# EAGLE board Main board Giulia (EAGLE 6.6.0)
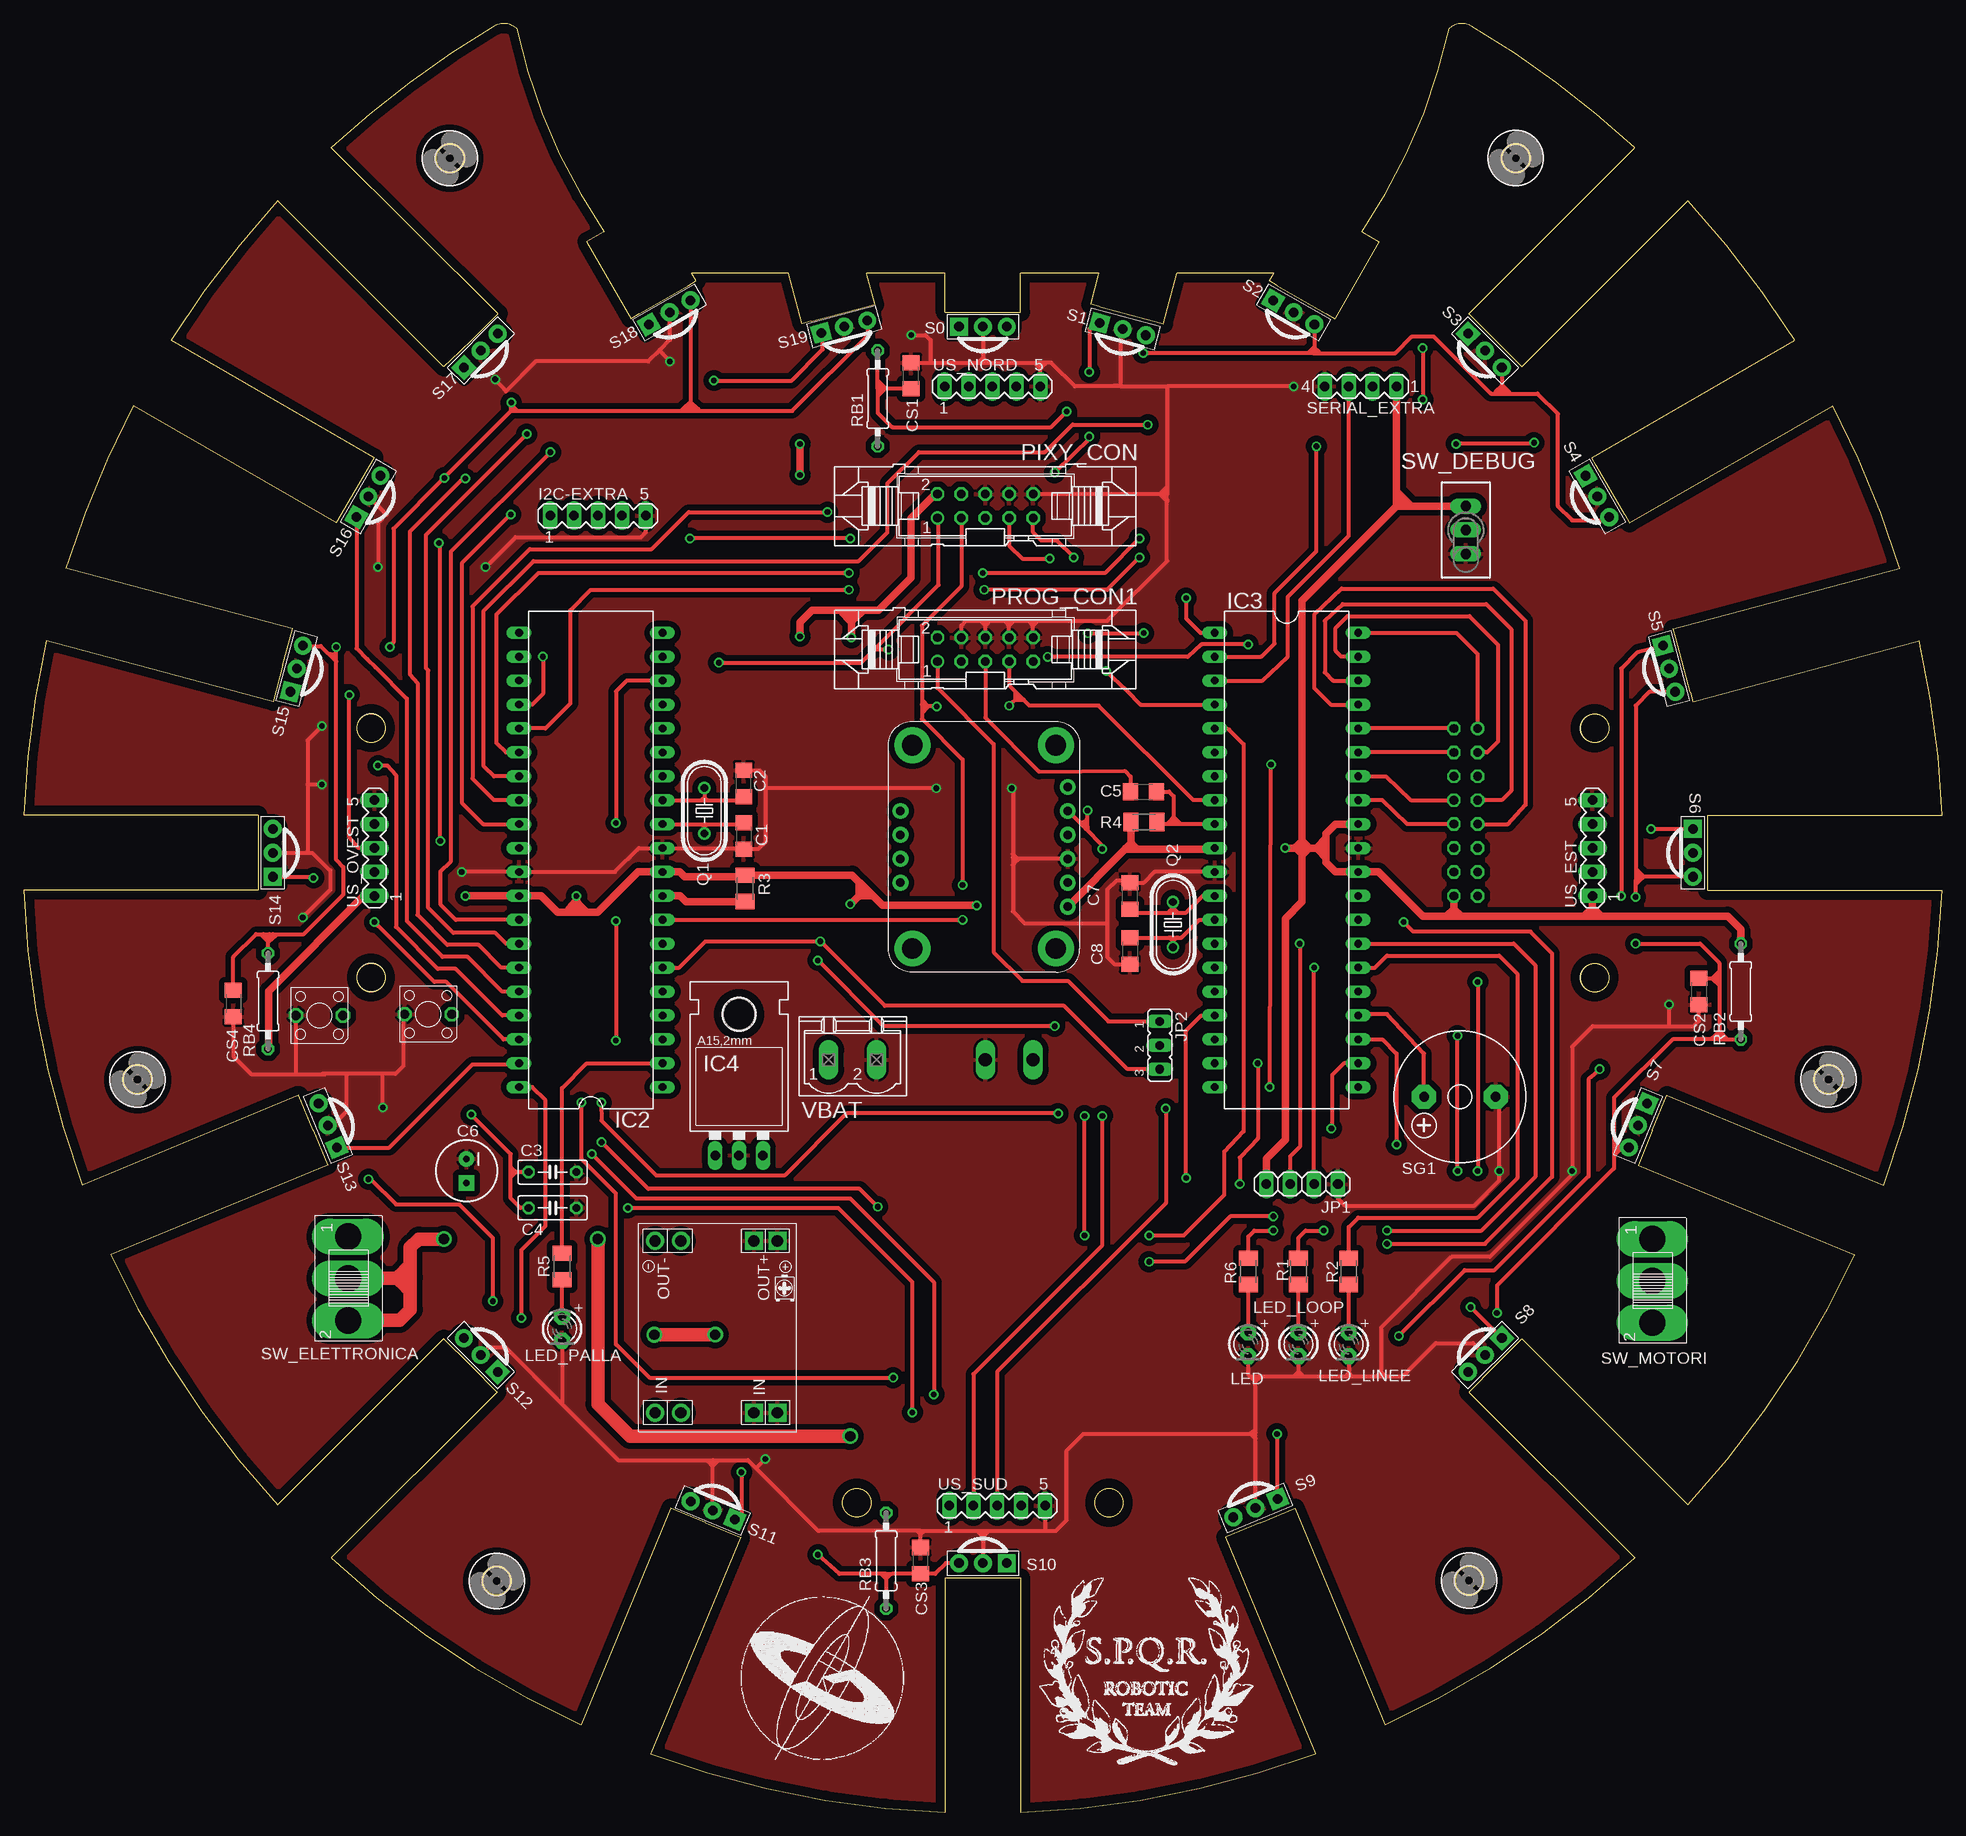
[diagram p1: board, top side]
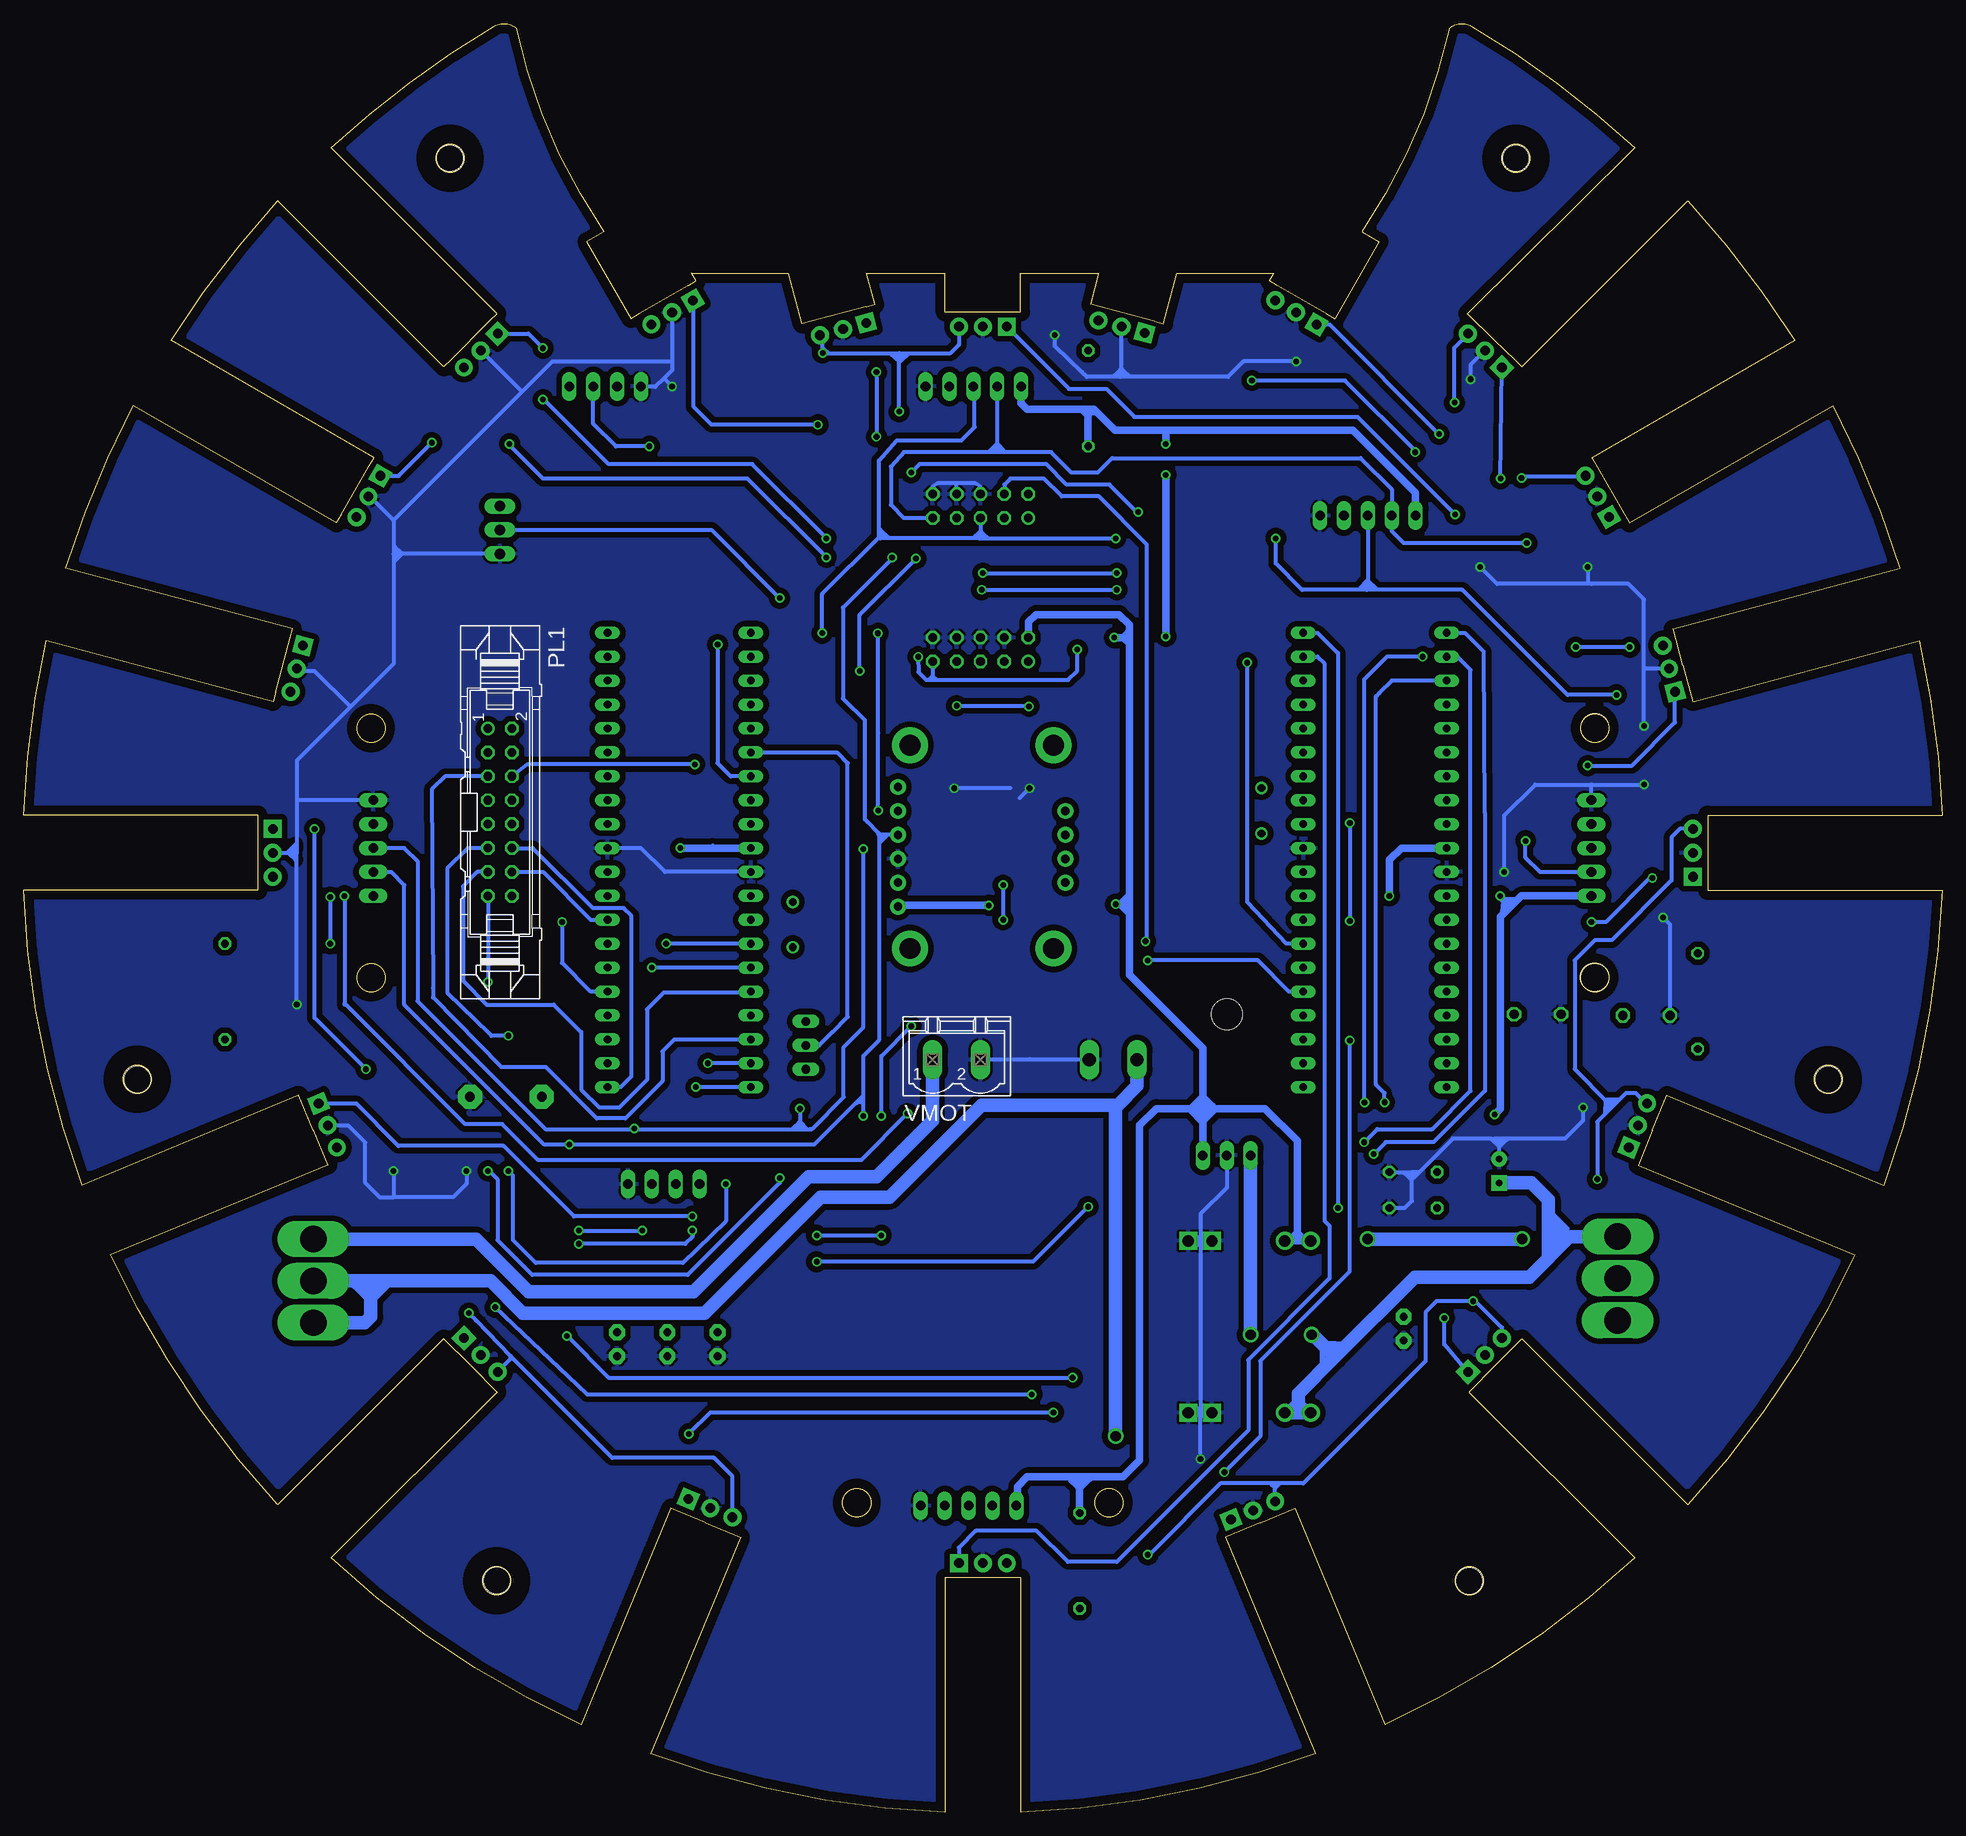
[diagram p2: board, bottom side, seen from below]

Size 203.84 x 190 mm. Coordinates in mm from the lower left corner, seen from the top.
Outline: 176.82,32.68 arc18 194.55,59.22 171.53,68.76 173.06,72.45 174.59,76.15 197.62,66.61 arc18 203.84,97.92 178.92,97.92 178.92,105.92 203.84,105.92 arc11 201.41,124.44 177.33,117.99 177.07,118.95 175.52,124.75 175.26,125.71 199.33,132.16 arc11 192.19,149.42 170.61,136.96 170.11,137.82 167.11,143.02 166.61,143.89 188.17,156.37 arc10 176.82,171.16 159.2,153.54 158.49,154.25 154.25,158.49 153.54,159.2 171.16,176.82 arc12 153.84,189.72 arc73 151.48,189.49 arc-22 142.18,167.88 144.01,166.83 139.3,158.66 138.43,159.16 133.24,162.16 132.37,162.66 132.85,163.48 122.56,163.48 121.12,158.11 120.15,158.37 114.36,159.92 113.39,160.18 114.28,163.48 105.92,163.48 105.92,159.36 97.92,159.36 97.92,163.48 89.57,163.48 90.45,160.18 89.49,159.92 83.69,158.37 82.72,158.11 81.28,163.48 71,163.48 71.47,162.66 70.61,162.16 65.41,159.16 64.55,158.66 59.83,166.83 61.66,167.88 arc-22 52.36,189.49 arc73 50.01,189.72 arc12 32.68,176.82 50.43,159.2 47.6,156.37 45.35,154.25 44.65,153.54 27.02,171.16 arc10 15.67,156.37 37.24,143.89 33.24,136.96 11.65,149.42 arc11 4.51,132.16 28.58,125.71 27.55,121.85 26.51,117.99 2.44,124.44 arc11 0,105.92 24.92,105.92 24.92,97.92 0,97.92 arc18 6.23,66.61 29.25,76.15 30.78,72.45 32.31,68.76 9.29,59.22 arc18 27.02,32.68 44.65,50.3 47.47,47.47 50.3,44.65 32.68,27.02 arc18 59.22,9.29 68.76,32.31 72.45,30.78 76.15,29.25 66.61,6.23 arc18 97.92,0 97.92,24.92 105.92,24.92 105.92,0 arc18 137.23,6.23 127.69,29.25 131.39,30.78 135.08,32.31 144.62,9.29 arc18 171.16,27.02 153.54,44.65 156.37,47.47 159.2,50.3 176.82,32.68
Outline: circle at 36.92,88.67 radius 1.5
Outline: circle at 36.92,115.17 radius 1.5
Outline: circle at 166.92,88.67 radius 1.5
Outline: circle at 166.92,115.17 radius 1.5
Outline: circle at 88.52,32.9 radius 1.5
Outline: circle at 50.25,24.59 radius 1.5
Outline: circle at 12.09,77.85 radius 1.5
Outline: circle at 45.31,175.7 radius 1.5
Outline: circle at 191.75,77.85 radius 1.5
Outline: circle at 158.54,175.7 radius 1.5
Outline: circle at 153.59,24.59 radius 1.5
Outline: circle at 166.92,115.17 radius 1.5
Outline: circle at 115.32,32.9 radius 1.5
Copper layers (1*16): Top 0.035mm / dielectric 1.5mm / Bottom 0.035mm
Design rules "default": minimum track width 10mil, minimum drill 24mil, track to track 8mil, track to pad 8mil, pad to pad 8mil, via to via 8mil, smd to smd 8mil, copper to edge 40mil, drill to drill 8mil, minimum pad ring 10mil, minimum via ring 8mil, stop-mask expansion 4mil, vias tented up to drill 0mil, thermal gap 10mil
Net classes: 0 default: width 0.152 mm; 1 Power: width 0.406 mm, clearance 0.61 mm
Holes 3 mm at 88.53,32.89 115.32,32.88 166.92,88.66 166.91,115.14 36.93,88.69 36.92,115.18

## Footprints (pad centres in the part's own frame; a part is rotated, then mirrored left to right if it is on the bottom)
C1206 = smd 1.6 x 1.8: 1 -1.4,0; 2 1.4,0
C050-025X075 = drill 0.813 octagon: 1 -2.54,0; 2 2.54,0
CPOL-RADIAL-100UF-25V = drill 0.7 pad 1.651 square: 1 1.27,0 | drill 0.7 pad 1.651: 2 -1.27,0
MA05-1 = drill 1.016 long: 1 -5.08,0; 2 -2.54,0; 3 0,0; 4 2.54,0; 5 5.08,0
DIL40 = drill 0.813 long: 1 -24.13,-7.62; 2 -21.59,-7.62; 3 -19.05,-7.62; 4 -16.51,-7.62; 5 -13.97,-7.62; 6 -11.43,-7.62; 7 -8.89,-7.62; 8 -6.35,-7.62; 9 -3.81,-7.62; 10 -1.27,-7.62; 11 1.27,-7.62; 12 3.81,-7.62; 13 6.35,-7.62; 14 8.89,-7.62; 15 11.43,-7.62; 16 13.97,-7.62; 17 16.51,-7.62; 18 19.05,-7.62; 19 21.59,-7.62; 20 24.13,-7.62; 21 24.13,7.62; 22 21.59,7.62; 23 19.05,7.62; 24 16.51,7.62; 25 13.97,7.62; 26 11.43,7.62; 27 8.89,7.62; 28 6.35,7.62; 29 3.81,7.62; 30 1.27,7.62; 31 -1.27,7.62; 32 -3.81,7.62; 33 -6.35,7.62; 34 -8.89,7.62; 35 -11.43,7.62; 36 -13.97,7.62; 37 -16.51,7.62; 38 -19.05,7.62; 39 -21.59,7.62; 40 -24.13,7.62
78XXL = drill 1.016 long: GND 0,-3.81; IN -2.54,-3.81; OUT 2.54,-3.81 | hole 3.302: 0,11.176
1X04 = drill 1.016 long: 1 -3.81,0; 2 -1.27,0; 3 1.27,0; 4 3.81,0
JP2 = drill 0.914 long: 1 -2.54,0; 2 0,0; 3 2.54,0
LED3MM = drill 0.813 pad 1.676 octagon: A -1.27,0; K 1.27,0
10V = drill 0.914: 1 -5.08,-1.27 | drill 0.914 octagon: 2 -5.08,1.27; 3 -2.54,-1.27; 4 -2.54,1.27; 5 0,-1.27; 6 0,1.27; 7 2.54,-1.27; 8 2.54,1.27; 9 5.08,-1.27; 10 5.08,1.27
16V = drill 0.914: 1 -8.89,-1.27 | drill 0.914 octagon: 2 -8.89,1.27; 3 -6.35,-1.27; 4 -6.35,1.27; 5 -3.81,-1.27; 6 -3.81,1.27; 7 -1.27,-1.27; 8 -1.27,1.27; 9 1.27,-1.27; 10 1.27,1.27; 11 3.81,-1.27; 12 3.81,1.27; 13 6.35,-1.27; 14 6.35,1.27; 15 8.89,-1.27; 16 8.89,1.27
HC49U-V = drill 0.813: 1 -2.413,0; 2 2.413,0
M1206 = smd 1.6 x 2: 1 -1.4,0; 2 1.4,0
0207/10 = drill 0.813 octagon: 1 -5.08,0; 2 5.08,0
PNA460XM = drill 1.016 pad 1.9 square: 1 -2.54,0 | drill 1.016 pad 1.9: 2 0,0; 3 2.54,0
MA04-1 = drill 1.016 long: 1 -3.81,0; 2 -1.27,0; 3 1.27,0; 4 3.81,0
F/CM12P = drill 1.016 pad 2.54 octagon: + 3.81,0; - -3.81,0
SWITCH_EVQ2 = drill 1 octagon: P$1 -2.5,0; P$2 2.5,0
TL3XPO = drill 1.1 pad 1.422 long: 1 -2.54,0; 2 0,0; 3 2.54,0
255SB = drill 2.8 pad 3.048 long: 1 2.667,3.556; 2 7.112,3.556; 3 11.557,3.556
MINI3ADCDCLM2595 = drill 1.2 pad 1.93: P$1 20.25,-1.75; P$2 2,-1.75; P$7 2,-4.5; P$8 20.25,-4.5 | drill 1.2 pad 1.93 square: P$3 2,-14.75; P$4 20.25,-14.75; P$5 2,-12.25; P$6 20.25,-12.25
BNO055 = drill 0.9 pad 1.676: 3V3 9.525,1.27; ADR 17.145,19.05; GND 12.065,1.27; INT 14.605,19.05; PS0 9.525,19.05; PS1 12.065,19.05; RST 19.685,1.27; SCL 17.145,1.27; SDA 14.605,1.27; VIN 6.985,1.27 | drill 2.2 pad 3.81: P$1 2.54,17.78; P$2 2.54,2.54; P$3 24.13,2.54; P$4 24.13,17.78
2,8 = hole 2.8: 0,0
MSTBV2 = drill 1.397 long: 1 -2.54,0; 2 2.54,0

## Placement (x,y rotation side)
C1  18p  [C1206]  76.52,103.7 270 top
C2  18p  [C1206]  76.52,109.29 90 top
C3  100n  [C050-025X075]  56.2,68.01 0 top
C4  100n  [C050-025X075]  56.2,64.2 0 top
C5  0.1uF  [C1206]  118.98,108.41 0 top
C6  47uF  [CPOL-RADIAL-100UF-25V]  47.06,68.14 270 top
C7  18p  [C1206]  117.54,97.35 90 top
C8  18p  [C1206]  117.54,91.51 270 top
CS1  22uF  [C1206]  94.3,152.59 90 top
CS2  22uF  [C1206]  177.99,87.19 270 top
CS3  22uF  [C1206]  95.32,26.74 90 top
CS4  22uF  [C1206]  22.29,85.92 270 top
I2C-EXTRA  [MA05-1]  61.03,137.74 0 top
IC2  ATMEGA644-20PU  [DIL40]  60.27,101.16 90 top
IC3  ATMEGA644-20PU  [DIL40]  134.18,101.16 270 top
IC4  [78XXL]  76.01,73.6 0 top
JP1  [1X04]  135.83,66.74 180 top
JP2  [JP2]  120.72,81.47 270 top
LED  [LED3MM]  130.12,49.72 270 top
LED_LINEE  [LED3MM]  140.78,49.72 270 top
LED_LOOP  [LED3MM]  135.45,49.72 270 top
LED_PALLA  [LED3MM]  57.22,51.38 270 top
PIXY_CON  [10V]  102.18,138.75 0 top
PL1  [16V]  153.23,106.24 270 bottom
PROG_CON1  [10V]  102.18,123.51 0 top
Q1  [HC49U-V]  72.33,106.4 90 top
Q2  [HC49U-V]  122.11,94.3 270 top
R1  330  [M1206]  135.45,57.47 270 top
R2  330  [M1206]  140.78,57.47 270 top
R3  10k  [M1206]  76.65,98.15 90 top
R4  10k  [M1206]  119.03,105.19 180 top
R5  330  [M1206]  57.22,57.98 270 top
R6  330  [M1206]  130.12,57.47 270 top
RB1  33  [0207/10]  90.75,150.18 90 top
RB2  33  [0207/10]  182.44,87.19 270 top
RB3  33  [0207/10]  91.63,26.74 270 top
RB4  33  [0207/10]  25.98,86.17 90 top
S0  PNA460XM  [PNA460XM]  101.92,157.8 0 top
S1  PNA460XM  [PNA460XM]  116.78,157.55 345 top
S2  PNA460XM  [PNA460XM]  134.94,159.33 330 top
S3  PNA460XM  [PNA460XM]  155.26,155.26 315 top
S4  PNA460XM  [PNA460XM]  167.2,139.77 300 top
S5  PNA460XM  [PNA460XM]  174.82,121.48 285 top
S6  PNA460XM  [PNA460XM]  177.36,101.92 270 top
S7  PNA460XM  [PNA460XM]  171.52,72.97 247.5 top
S8  PNA460XM  [PNA460XM]  155.26,48.58 225 top
S9  PNA460XM  [PNA460XM]  130.88,32.33 202.5 top
S10  PNA460XM  [PNA460XM]  101.92,26.48 180 top
S11  PNA460XM  [PNA460XM]  73.22,32.07 157.5 top
S12  PNA460XM  [PNA460XM]  48.58,48.58 135 top
S13  PNA460XM  [PNA460XM]  32.33,72.97 112.5 top
S14  PNA460XM  [PNA460XM]  26.48,101.92 90 top
S15  PNA460XM  [PNA460XM]  29.02,121.48 75 top
S16  PNA460XM  [PNA460XM]  36.64,139.77 60 top
S17  PNA460XM  [PNA460XM]  48.58,155.26 45 top
S18  PNA460XM  [PNA460XM]  68.65,159.33 30 top
S19  PNA460XM  [PNA460XM]  87.19,157.8 15 top
SERIAL_EXTRA  [MA04-1]  142.05,151.45 180 top
SG1  F/CM12P  [F/CM12P]  152.59,76.01 180 top
SW1  SWITCH-MOMENTARY-2  [SWITCH_EVQ2]  31.44,84.65 180 top
SW2  SWITCH-MOMENTARY-2  [SWITCH_EVQ2]  42.99,84.78 180 top
SW_DEBUG  TL38PO  [TL3XPO]  153.23,136.21 90 top
SW_ELETTRONICA  [255SB]  30.93,63.82 270 top
SW_MOTORI  [255SB]  169.49,63.57 270 top
U$1  [MINI3ADCDCLM2595]  65.35,40.45 90 top
U$17  BNO055  [BNO055]  112.21,89.22 90 top
US_EST  [MA05-1]  166.69,102.43 90 top
US_HOLE1  2.8  [2,8]  153.56,24.63 0 top
US_HOLE2  2.8  [2,8]  12.11,77.84 0 top
US_HOLE3  2.8  [2,8]  50.27,24.57 0 top
US_HOLE4  2.8  [2,8]  45.29,175.69 0 top
US_HOLE5  2.8  [2,8]  158.54,175.7 0 top
US_HOLE6  2.8  [2,8]  191.75,77.85 0 top
US_NORD  [MA05-1]  102.94,151.45 0 top
US_OVEST  [MA05-1]  37.28,102.43 90 top
US_SUD  [MA05-1]  103.45,32.58 0 top
VBAT  MSTBV2  [MSTBV2]  88.08,79.95 0 top
VMOT  MSTBV2  [MSTBV2]  104.72,79.95 0 bottom

## Tracks (layer width: path | path; a pad name or v marks a point on that pad's centre or on a via)
5V  (via drill 0.6)
  Top 0.406: 153.19,138.71 SW_DEBUG.3 | 52.52,97.48 IC2.32 | 151.96,95.44 152.21,95.19 | 166.69,96.33 167.71,95.32 167.58,95.32 167.2,95.7 | 151.96,96.08 152.09,96.08 152.85,95.32 152.72,95.32 151.96,96.08 | 151.96,96.08 151.83,96.08 151.07,95.32 | v47.57,74.11 51.76,69.92 51.76,67.89 | C4.1 52.77,64.2 51.76,65.22 51.76,67.89 | C3.1 51.88,68.01 51.76,67.89 | 126.43,102.3 126.56,102.3 IC3.10
  Top 0.813: SERIAL_EXTRA.1 145.86,138.71 | 145.86,138.71 135.83,128.68 135.83,102.56 | v46.96,97.35 IC2.32 55,97.35 56.72,95.63 58.8,95.63 | 82.49,124.78 v82.49,124.91 82.49,126.41 83.77,127.69 87.95,127.69 | PIXY_CON.2 96.84,140.02 94.3,137.48 94.3,131.13 90.86,127.69 87.95,127.69 | JP1.4 132.02,69.41 134.05,71.44 134.05,94.94 135.83,96.71 135.83,102.56 | 166.69,95.19 152.21,95.19 148.66,95.19 143.96,99.89 IC3.30 139.39,99.89 138.37,100.91 138.37,102.3 | US_EST.1 166.69,96.33 166.69,95.19 | IC3.32 139.39,104.97 138.37,103.95 138.37,102.3 | PL1.16 151.96,96.08 151.96,95.44 | RB2.1 182.44,93.79 181.04,95.19 166.69,95.19 | v82.49,145.36 v82.49,142.05 | U$17.VIN 117.03,102.3 117.39,102.3 | 153.19,138.71 145.86,138.71 | 138.37,102.3 138.24,102.43 135.96,102.43 | 135.96,102.43 135.83,102.56 | v134.05,102.43 135.96,102.43 | 126.43,102.3 117.39,102.3 | 89.5,98.09 88.04,99.55 R3.2 76.48,99.38 70.23,99.38 69.71,99.89 IC2.10 67.85,99.92 65.3,99.92 61.01,95.63 58.8,95.63 | 89.5,98.09 91.25,96.33 v101.29,96.33 | US_OVEST.1 36.13,97.35 26.02,87.24 26.02,81.14 RB4.1 | v87.82,96.46 87.87,96.46 89.5,98.09 | R4.2 117.63,102.55 117.39,102.3 | 87.95,127.69 v87.95,124.78 | v58.74,97.35 58.74,95.69 58.8,95.63
  Bottom 0.305: 90.11,149.04 91.17,149.04
  Bottom 0.406: 90.75,148.91 90.62,149.04 | 90.49,35.37 91.63,34.23 91.63,34.61 91,35.25 | 68.52,61.66 69.41,60.77 | 130.62,102.68 130.37,102.43
  Bottom 0.61: 46.93,74.74 v47.57,74.11
  Bottom 0.813: IC3.10 130.37,102.43 v134.05,102.43 | v82.49,124.91 v82.49,142.05 | IC2.30 57.47,102.43 58.74,101.16 v58.74,97.35 | US_NORD.1 97.86,149.67 97.22,149.04 91.17,149.04 90.62,149.04 | 90.11,149.04 87.89,146.81 82.52,146.81 | I2C-EXTRA.1 55.95,140.15 61.28,145.48 61.28,145.5 62.6,146.81 82.52,146.81 | RB1.1 90.75,148.91 | 78.43,69.92 IC4.OUT 78.55,74.62 | 78.55,74.62 78.55,74.74 | 78.55,74.74 78.55,81.16 86.37,88.98 86.37,95.9 | 78.55,74.62 78.68,74.74 83.51,74.74 85.28,72.97 85.28,37.41 87.06,35.63 91.63,35.63 | 91.63,35.63 97.22,35.63 98.24,34.61 98.24,32.71 US_SUD.1 | RB3.1 91.63,34.23 91.63,35.63 | U$1.P$8 68.39,60.7 | 68.39,60.7 U$1.P$1 | 78.55,74.74 71.95,74.74 68.52,71.31 68.52,61.66 68.52,60.83 68.39,60.7 | 96.97,124.65 PROG_CON1.2 97.06,124.82 97.06,126.44 96.28,127.22 87.45,127.22 86.37,126.15 86.37,124.76 | v87.82,96.46 86.94,96.46 86.37,95.9 | v101.29,96.33 110.81,96.33 U$17.VIN | US_OVEST.1 44.71,97.35 45.88,96.18 | 45.88,96.18 46.95,95.11 46.95,74.72 v47.57,74.11 | v46.96,97.35 46.96,97.26 45.88,96.18 | v87.95,124.78 86.39,124.78 86.37,124.76 | 86.37,95.9 86.37,124.76 | v82.49,145.36 82.49,146.78 82.52,146.81
+12V  (via drill 1.1)
  Top 1.422: v73.47,50.74 v73.47,50.73 v67,50.73
  Bottom 1.422: 67,50.87 v67,50.73 | 41.85,61.15 SW_ELETTRONICA.1 | IC4.IN v73.47,50.74 | U$1.P$2 68.52,42.45 | 68.52,42.45 U$1.P$7 | v67,50.73 | 68.52,42.45 68.39,42.58 68.39,44.49 64.5,48.38 | C6.1 43.63,66.87 41.85,65.09 41.85,61.15 | 41.85,61.15 41.85,58.87 43.88,56.84 56.04,56.84 64.5,48.38 | v67,50.73 66.86,50.73 64.5,48.38
BUZZER
  Top 0.406: SG1.+ 148.78,80.59 144.85,84.78 141.93,84.78 IC3.24
DEBUG  (via drill 0.6)
  Top 0.406: v123.51,128.97 123.51,126.81 125.04,125.29 IC3.1
  Bottom 0.406: SW_DEBUG.2 130.75,136.21 v123.51,128.97
DRIVERA_A
  Top 0.406: IC3.40 152.21,125.29 154.5,123 PL1.1
DRIVERA_B
  Top 0.406: IC3.39 140.02,122.75 139.39,123.38 139.39,125.8 140.66,127.07 153.61,127.07 156.66,124.02 156.66,113.73 155.52,112.59 PL1.3
DRIVERA_PWM
  Bottom 0.406: PL1.5 159.07,110.05 160.47,108.65 160.34,87.57 160.34,86.55 153.1,79.19 148.4,79.19 142.94,73.73 139.89,73.73 135.96,77.66 135.96,80.84 134.69,82.11 IC3.18
DRIVERB_A
  Top 0.406: IC3.38 139.13,120.21 138.24,121.1 138.24,126.56 140.15,128.34 155.39,128.34 158.06,125.67 158.06,108.53 157.04,107.51 PL1.7
DRIVERB_B
  Top 0.406: IC3.37 138.88,117.67 137.1,119.45 137.1,127.19 140.02,129.99 156.15,129.99 159.58,126.56 159.58,107 157.67,104.97 PL1.9
DRIVERB_PWM  (via drill 0.6)
  Top 0.406: v131.13,79.57 131.13,71.57 129.23,69.54 v129.23,66.74 | v152.34,68.14 v152.34,82.49
  Bottom 0.406: PL1.11 156.66,102.43 158.82,100.27 158.82,87.06 154.37,82.74 154.12,82.49 v152.34,82.49 | v129.23,66.74 129.23,62.81 133.8,58.36 149.42,58.36 151.83,60.77 151.83,67.63 v152.34,68.14 | IC3.19 v131.13,79.57
DRIVERC_A
  Top 0.406: PL1.2 IC3.36
DRIVERC_B
  Top 0.406: PL1.4 IC3.35
DRIVERC_PWM  (via drill 0.6)
  Top 0.406: v132.4,77.03 v132.53,111.32
  Bottom 0.406: IC3.20 v132.4,77.03 | v132.53,111.32 150.31,111.32 PL1.6
DRIVERD_A
  Top 0.406: IC3.34 144.72,110.05 147.39,107.51 PL1.8
DRIVERD_B
  Top 0.406: PL1.10 147.01,104.97 144.34,107.51 IC3.33
DRIVERD_PWM
  Bottom 0.406: PL1.12 149.74,102.43 143.35,96.04 140.09,96.04 139.26,95.21 139.26,78.17 140.4,77.03 IC3.21
GND  (via drill 0.6)
  Top 0.254: SG1.- | v156.78,68.15 v156.79,68.14
  Top 0.305: 135.7,46.68 136.08,46.3 135.96,46.3 135.7,46.55 135.7,46.68 | 135.7,46.68 135.45,46.93 134.94,46.42 | 141.29,46.3 140.78,46.8 140.28,46.3 | 144.85,46.3 144.21,46.93 143.7,46.42
  Top 0.406: S9.2 130.88,39.69 | 130.88,39.69 130.88,40.33 | S0.2 101.92,154.5 | 101.92,154.5 101.92,153.99 | 101.92,153.99 102.43,153.99 | CS1.2 96.3,153.99 | 96.3,153.99 101.92,153.99 | 102.43,153.99 107.89,153.99 108.02,153.86 | 108.02,153.86 108.02,153.36 | 130.37,40.2 112.59,40.2 110.81,38.42 110.81,31.06 109.67,29.91 108.6,29.91 | 130.37,40.2 130.75,40.2 130.88,40.33 | 101.92,29.91 101.92,29.53 | 101.92,29.53 101.92,29.28 | 101.92,29.28 S10.2 | CS3.2 95.32,29.53 | 95.32,29.53 95.32,29.91 | 95.32,29.91 101.54,29.91 101.92,29.53 | S11.2 73.22,36.77 | 73.22,36.77 73.22,37.41 | v46.55,99.89 IC2.31 62.81,99.89 65.35,102.43 IC2.11 76.39,102.43 C1.2 | 29.02,78.43 31.71,78.43 | 31.71,78.43 32.07,78.43 | I2C-EXTRA.5 66.11,135.96 65.6,135.45 52.26,135.45 v49.09,132.27 | 108.14,153.99 109.16,153.99 111.7,151.45 116.65,151.45 | 108.14,153.99 108.02,153.86 | S8.2 153.99,49.85 150.05,49.85 146.5,46.3 144.85,46.3 144.09,46.3 | SW1.P$2 28.94,78.59 29.02,78.43 | CS4.2 22.29,80.33 24.2,78.43 29.02,78.43 | 121.48,140.02 120.72,140.02 | 120.72,140.02 PIXY_CON.10 | 144.09,46.3 141.29,46.3 140.91,46.3 | 140.91,46.3 140.28,46.3 136.08,46.3 135.2,46.3 | LED.K 130.12,46.55 130.37,46.3 | LED_LOOP.K 135.45,46.93 135.45,46.55 135.2,46.3 | LED_LINEE.K 140.78,46.8 140.78,46.42 140.91,46.3 | 144.09,46.3 144.21,46.42 144.21,46.93 144.21,51.5 151.71,59 155.77,59 164.53,67.76 v164.53,68.14 164.53,81.31 166.72,83.5 174.84,83.5 | 101.92,29.91 102.56,29.91 | 102.56,29.91 108.6,29.91 | PROG_CON1.4 99.64,126.05 100.14,126.56 101.67,126.56 | 101.67,126.56 102.43,126.56 | 102.43,126.56 102.68,126.56 | 102.68,126.56 104.21,126.56 | 104.21,126.56 104.59,126.56
  Top 0.406: 104.59,126.56 105.22,126.56 | 105.22,126.56 106.75,126.56 | 106.75,126.56 107.38,126.56 | 107.38,126.56 107.76,126.56 | 107.76,126.56 115.13,126.56 121.48,132.91 121.48,139.26 | PROG_CON1.6 102.18,126.05 | 102.18,126.05 102.18,126.31 102.43,126.56 | PROG_CON1.8 104.72,126.05 | 104.72,126.05 104.72,126.43 104.59,126.56 | PROG_CON1.10 107.26,126.05 | 107.26,126.05 107.26,126.43 107.38,126.56 | v156.79,68.14 156.79,67.12 154.12,64.46 140.4,64.46 139.64,65.22 JP1.1 | S1.2 116.53,157.29 116.53,151.58 116.65,151.45 | 121.48,139.39 121.48,140.02 | v37.66,132.27 37.66,136.97 38.53,137.87 S16.2 | v134.94,151.45 121.48,151.45 | US_NORD.5 108.02,153.36 | 108.02,153.86 108.02,153.99 108.14,153.99 | 116.65,151.45 121.48,151.45 | 121.48,151.45 121.48,140.78 | 121.48,140.78 121.48,140.02 | SW2.P$2 40.33,84.74 40.33,79.25 39.55,78.47 39.55,78.46 | 57.22,43.37 63.19,37.41 73.22,37.41 | 117.29,89.86 C8.2 115.89,90.11 115.13,90.87 115.13,94.43 | v104.97,108.78 105.1,108.65 105.1,101.79 | 115.13,94.43 115.13,97.98 116.15,99 117.29,99 C7.2 119.02,98.75 120.16,99.89 IC3.11 | 76.4,102.18 C1.2 | C2.2 78.17,110.69 78.81,110.05 78.81,103.06 78.05,102.3 C1.2 | v96.97,108.78 79.06,108.78 | 115.13,94.43 106.37,94.43 105.1,95.7 105.1,100.65 | 101.67,29.91 101.92,29.91 | 102.05,29.4 102.56,29.91 | 101.92,29.28 101.41,29.79 | 95.32,29.53 95.57,29.79 | 95.32,29.53 95.06,29.79 | 73.22,36.77 73.73,37.28 | 73.22,36.77 72.71,37.28 | LED_PALLA.K 57.22,43.37 | 57.22,43.37 51.25,49.34 49.34,49.34 S12.2 | 108.02,153.36 108.53,153.86 | 108.02,153.36 107.51,153.86 | 115.89,151.58 116.27,151.58 | 121.48,140.78 120.84,140.15 121.23,140.15 121.35,140.28
  Top 0.406: 120.72,140.02 121.48,139.26 | 121.48,139.26 121.48,139.39 | 121.48,139.39 121.1,139.77 | 135.2,46.3 131.39,46.3 | 131.26,46.3 130.37,46.3 | 130.88,40.33 130.88,40.71 | 130.88,40.71 130.88,45.79 | 130.88,45.79 130.37,46.3 | 130.88,45.79 131.39,46.3 | 131.39,46.3 131.26,46.3 | 131.26,46.3 131,46.04 | 130.88,40.71 130.37,40.2 | 130.37,40.2 130.88,39.69 | 101.41,153.99 101.92,154.5 | 101.92,154.5 102.43,153.99 | 102.68,126.56 102.18,126.05 | 102.18,126.05 101.67,126.56 | 104.21,126.56 104.72,126.05 | 104.72,126.05 105.22,126.56 | 107.76,126.56 107.26,126.05 | 107.26,126.05 106.75,126.56 | S18.2 68.65,156.4 67.57,155.33 | 67.57,155.33 66.36,154.12 54.42,154.12 51.25,150.94 v50.11,152.21 | v68.65,154.12 67.57,155.33 | 30.17,109.16 30.17,113.86 v31.69,115.38 | v29.66,95.06 32.58,97.98 32.58,100.02 30.67,101.92 30.17,101.92 | S14.2 30.17,101.92 | 105.1,101.79 105.1,101.41 | 105.1,101.41 105.1,100.65 | U$17.GND 105.6,101.29 | 105.6,101.29 105.22,101.29 105.1,101.41 | 105.1,100.65 105.6,101.16 | 105.1,101.79 105.6,101.29 | 174.84,83.5 177.43,83.5 178,84.07 CS2.2 | v174.82,85.79 174.82,83.52 174.84,83.5 | v94.3,156.91 95.82,156.91 96.36,156.37 96.36,154.06 96.3,153.99 | 77.81,36.56 76.96,37.41 73.22,37.41 | 77.81,36.56 84.49,29.88 84.52,29.91 95.32,29.91 | US_SUD.5 108.53,29.98 108.6,29.91 | v156.78,68.15 156.78,75.64 SG1.- | 30.17,109.16 30.17,101.92 | v31.69,109.16 30.17,109.16 | v78.81,37.53 78.78,37.53 77.81,36.56 | 39.53,78.44 39.52,78.44 38.23,78.44 | 38.23,78.44 34.46,78.44 | 34.46,78.44 31.72,78.44 31.71,78.43 | v38.17,74.87 38.17,78.38 38.23,78.44 | S13.2 32.82,72.97 34.34,74.48 34.34,78.32 34.46,78.44
  Bottom 0.406: IC3.11 135.7,99.89 138.24,102.43 IC3.31 | v174.82,85.79 174.82,101.92 | S6.2 174.82,101.92 | S4.2 167.07,139.77 164.53,137.23 | S3.2 155.26,155.13 155.13,155.13 150.88,150.88 | 150.88,150.88 147.64,154.12 135.03,154.12 134.94,154.03 | v94.3,156.91 94.3,155.77 91.38,152.97 | 91.38,152.97 91.13,152.72 | 87.19,153.23 87.19,152.59 87.32,152.47 | 87.19,153.23 87.19,153.36 | 87.19,153.36 S19.2 | S17.2 50.11,153.74 v50.11,152.21 | 78.93,60.7 U$1.P$6 78.74,60.7 78.81,60.77 78.81,42.58 78.68,42.45 | 78.93,60.7 U$1.P$4 | S7.2 169.36,72.97 167.55,71.15 167.55,66.88 166.02,65.35 164.5,65.35 | SW1.P$2 28.9,84.74 28.9,94.3 v29.66,95.06 | PIXY_CON.6 102.18,140.78 102.68,141.16 104.72,141.16 | 104.72,141.16 106.75,141.16 107.26,140.78 PIXY_CON.10 | PIXY_CON.8 104.72,141.16 | 150.88,150.88 164.53,137.23 | 164.53,137.23 164.53,133.67 | 164.53,133.67 164.53,121.99 169.1,117.42 | 169.1,117.42 174.82,111.7 174.82,101.92 | 169.1,117.42 172.91,121.23 174.57,121.23 S5.2 | US_EST.5 174.57,107.51 | SW_DEBUG.1 163.64,133.67 | 163.64,133.67 164.15,133.67 | 164.15,133.67 164.53,133.67 | v46.55,99.89 46.55,105.86 43.25,109.16 37.28,109.16 | 37.28,109.16 v31.69,109.16 | US_OVEST.5 37.28,109.16 | v31.69,115.38 31.69,121.48 | S15.2 31.69,121.48 | C6.2 47.06,70.68 | 47.06,70.68 47.06,71.44 | 47.06,71.44 46.93,71.57 | U$1.P$5 78.68,42.45 | 78.68,42.45 79.06,42.45 | 79.06,42.45 U$1.P$3 | C4.2 57.09,64.2 56.33,64.96 56.33,67.25 | 56.33,67.25 56.33,67.38 | 56.33,67.38 56.33,67.89 | 56.33,67.89 56.33,68.01 C3.2 | 47.18,71.57 47.06,71.44 | v68.65,154.12 74.24,154.12 75.89,152.47 87.32,152.47 | 87.32,152.47 90.88,152.47 91.38,152.97 | v38.17,74.87 38.17,73.47 40.07,71.57 46.17,71.57
  Bottom 0.406: 46.17,71.57 46.93,71.57 | 55.57,68.01 56.2,68.01 56.33,67.89 | IC4.GND 76.01,66.36 78.81,63.57 78.81,60.83 78.93,60.7 | v78.81,37.53 78.81,42.2 79.06,42.45 | 47.18,71.57 47.57,71.57 | 47.95,71.57 52.01,71.57 55.57,68.01 | 47.06,70.68 47.95,71.57 | 47.95,71.57 47.57,71.57 | 47.57,71.57 47.31,71.31 | 47.18,71.57 46.93,71.57 | 47.06,70.68 46.42,71.31 46.8,71.31 46.93,71.19 46.55,71.19 46.17,71.57 | 87.19,153.23 87.32,153.23 87.95,152.59 87.57,152.59 87.32,152.85 | 87.19,153.36 86.55,152.72 | 86.94,152.85 86.81,152.72 86.55,152.72 | 86.55,152.72 86.43,152.59 | 56.33,67.38 56.84,67.89 | 56.33,67.38 55.95,67.76 | 55.57,68.01 56.2,67.38 | 56.33,67.25 56.46,67.25 57.09,67.89 | 163.64,133.67 164.41,134.43 164.41,134.05 164.28,133.93 | 163.64,133.67 164.41,132.91 164.41,133.42 164.15,133.67 | 99,108.78 v104.97,108.78 | v96.97,108.78 97.98,107.76 | 31.69,121.48 31.69,128.85 33.34,130.5 37.28,130.5 | 37.28,130.5 47.31,130.5 v49.09,132.27 | v37.66,132.27 37.67,130.56 37.28,130.5 | 138.22,151.43 SERIAL_EXTRA.4 138.19,151.4 136.73,151.4 135.81,152.32 | 134.99,151.45 v134.94,151.45 135.81,152.32 | S2.2 134.94,154.03 | 134.94,154.03 134.94,153.19 135.81,152.32 | VBAT.2 97.04,79.95 | 97.04,79.95 VMOT.2 | 96.97,80.02 97.04,79.95 | v156.79,68.14 156.79,66.79 158.22,65.35 164.5,65.35 | 164.5,65.35 164.49,65.37 164.53,65.42 v164.53,68.14
  pour Bottom: -13.59,200.03 -13.25,-4.21 212.92,-4.21 212.59,194.6 212.62,194.6 212.62,200.36
  pour Top: -10.66,202.69 -10.66,-11.03 216.41,-11.03 216.41,201.85 169.15,202.67
INTERRUPT
  Bottom 0.406: PL1.14 148.66,99.89 143.58,94.81 IC3.28
LED  (via drill 0.6)
  Top 0.406: v146.63,94.56 147.64,93.54 160.09,93.54 162.37,91.25 162.37,67.5 155.26,60.39 v144.85,60.39 | R6.1 130.12,61.15 130.75,61.79 v132.78,61.79
  Bottom 0.406: IC3.25 143.58,87.19 146.63,90.24 v146.63,94.56 | v132.78,61.79 132.78,61.15 133.54,60.39 v144.85,60.39
LED_LINEE
  Top 0.406: IC3.26 143.58,89.73 144.85,91 156.79,91 158.69,89.09 158.69,67.38 154.5,63.19 141.8,63.19 140.79,62.17 140.79,60.39 140.78,60.39 R2.1
LED_LOOP  (via drill 0.6)
  Top 0.406: IC3.27 158.31,92.27 160.6,89.98 160.6,67.5 154.88,61.79 v144.85,61.79 | R1.1 135.45,61.03 136.21,61.79 v138.12,61.79
  Bottom 0.406: v144.85,61.79 v138.12,61.79
LED_PALLA
  Top 0.406: R5.1 57.22,76.94 59.84,79.56 IC2.2
MISO_ISP  (via drill 0.6)
  Top 0.406: v73.85,122.11 88.97,122.11 90.36,123.51 | 90.36,123.51 97.22,130.37 97.22,137.35 PIXY_CON.1 | v91.89,123.51 90.36,123.51 | v130.1,124.05 125.15,124.05 123.7,122.72 109.54,122.72 v108.8,122.74
  Bottom 0.406: IC2.7 69.66,92.27 73.85,96.71 v73.85,122.11 | v130.1,124.05 130.12,111.45 128.72,110.05 IC3.7 | v108.8,122.74 108.78,121.12 107.94,120.29 107.35,120.29 | 107.35,120.29 92.87,120.29 91.89,121.26 v91.89,123.51 | PROG_CON1.9 107.26,120.38 107.35,120.29
MOSI_ISP  (via drill 0.6)
  Top 0.406: IC2.6 69.66,89.73 72.46,92.52 v84.65,92.52 91.51,85.67 110.56,85.67 117.29,78.93 JP2.3
  Bottom 0.406: PIXY_CON.4 99.64,141.04 99,141.67 95.44,141.67 93.54,139.77 89.6,139.77 84.52,134.69 84.52,92.65 v84.65,92.52
MOSI_ISP_1
  Bottom 0.406: 120.59,81.35 JP2.2 119.32,81.47 117.92,82.87 117.91,82.87 116.28,84.5 116.28,111.45 117.43,112.59 IC3.6
MOSI_ISP_1_PROG
  Top 0.406: PROG_CON1.1 97.1,119.45 103.06,113.48 103.06,91.38 106.11,88.33 110.94,88.33 115.26,84.01 JP2.1
N$1
  Top 0.406: IC2.12 72.46,104.97 | 72.46,104.97 76.39,104.97 C1.1 | Q1.1 72.33,104.84 72.46,104.97
N$3
  Top 0.406: IC2.13 72.46,107.51 | 72.46,107.51 76.14,107.51 C2.1 | Q1.2 72.33,107.64 72.46,107.51
N$4
  Bottom 0.406: 78.68,76.01 78.81,76.01 79.95,74.87 79.57,74.87 78.81,75.63 78.81,75.38 79.06,75.12
N$5
  Top 0.406: LED.A R6.2
N$6
  Top 0.406: LED_LOOP.A R1.2
N$7  (via drill 1.1)
  Top 1.422: SW_ELETTRONICA.2 40.96,56.71 41.09,56.84 | v61.03,60.9 61.03,43.37 64.46,39.95 v87.81,39.95 v87.82,39.96 | SW_ELETTRONICA.3 39.95,52.26 41.09,53.41 41.09,56.84 | 41.09,56.84 41.09,60.01 41.98,60.9 v44.64,60.9
  Bottom 0.406: 165.93,55.82 166.31,55.44 166.31,55.06 165.29,56.07 164.91,56.07 166.69,54.3 166.95,54.3 167.07,54.3 168.6,55.82
  Bottom 1.422: 166.95,56.46 154.25,56.46 150.82,53.03 131.51,53.03 119.19,65.35 111.83,65.35 102.05,75.12 87.57,75.12 | 166.95,56.46 SW_MOTORI.2 | SW_MOTORI.3 167.58,52.01 166.95,52.65 166.95,54.3 166.95,56.46 | v44.64,60.9 v61.03,60.9 | VBAT.1 85.54,77.16 87.57,75.12 | 87.57,75.12 87.82,74.87 v87.82,39.96
N$8
  Bottom 0.406: 78.43,76.14 77.41,75.12 77.92,75.12 78.17,75.38
N$9
  Top 0.406: IC3.12 125.29,97.35 123.51,95.57 122.62,95.57 | C7.1 118.3,95.57 121.61,95.57 | Q2.1 122.11,96.08 | 122.11,96.08 122.11,95.57 | 121.61,95.57 122.62,95.57 | 122.62,95.57 122.11,96.08 | 122.11,96.08 121.61,95.57
N$10
  Bottom 0.406: 78.68,73.09 78.68,73.22 79.95,74.49 79.44,74.49 78.93,73.98
N$11
  Bottom 0.406: 78.93,74.11 78.93,74.24
N$12
  Bottom 0.406: 77.28,74.62 77.28,74.49 78.3,73.47 78.3,73.85 77.79,74.36
N$13
  Bottom 0.406: 91.89,34.99 92.27,35.37 92.65,35.37 91.76,34.48 91.89,34.48 92.65,35.25
N$14
  Bottom 0.406: 167.07,54.3 167.07,54.42 168.72,56.07 168.34,56.07 167.58,55.31 167.58,55.82
N$15
  Bottom 0.406: 167.07,54.55 167.45,54.55 168.72,55.82
N$16
  Top 0.406: C8.1 122.11,92.91 122.11,92.52 | Q2.2 122.11,92.52 | 122.5,92.9 122.11,92.52 | 122.11,92.52 121.73,92.9 | 122.5,92.9 122.62,92.9 123,92.9 124.91,94.81 IC3.13 | 121.86,92.9 122.5,92.9
N$17
  Top 0.406: LED_PALLA.A R5.2
N$18
  Bottom 0.406: 40.07,61.66 40.07,61.79 41.34,63.06 41.34,62.68 40.45,61.79 40.96,61.79 41.22,62.04
N$19
  Bottom 0.406: 40.07,60.9 40.07,60.65 41.6,59.12 41.6,59.63 40.58,60.65 41.09,60.65 41.34,60.39
N$20
  Bottom 0.406: 39.95,60.52 41.47,59
N$21
  Top 0.406: LED_LINEE.A R2.2
N$22
  Bottom 0.406: 39.56,60.65 39.56,60.52 41.6,58.49
N$23
  Bottom 0.406: 39.82,61.66 39.82,62.04 41.34,63.57
N$24
  Bottom 0.406: 174.95,101.16 175.58,101.79 175.33,101.79 175.07,101.54
N$25
  Bottom 0.406: 174.95,102.68 175.07,102.68 | 175.07,102.68 175.71,102.05 | 175.07,102.68 174.95,102.81 174.95,102.43 175.2,102.18
N$26
  Bottom 0.61: 65.88,47.42 65.83,47.42 65.83,49.13
N$28
  Bottom 0.61: 63.83,49.74 65.45,49.74 65.45,49.75 64.53,49.75 64.53,49.42
N$30
  Bottom 0.406: 67.76,61.03 68.39,61.66
N$31
  Bottom 0.406: 68.65,61.66 69.41,60.9
N$32
  Bottom 0.406: 67.25,42.74 67.25,42.87 68.01,43.63
N$33
  Bottom 0.406: 68.77,43.63 68.9,43.63 69.54,42.99
N$34
  Top 0.406: 39.69,56.46 39.69,56.07 40.83,54.93 40.83,55.31 39.82,56.33
N$35
  Top 0.406: 39.56,56.96 39.56,57.34 40.58,58.36 40.58,57.98 40.07,57.47 40.33,57.47
N$41
  Top 0.406: 146.12,139.89 147.01,139.01 146.5,139.01 146.24,139.26
N$43
  Top 0.406: 168.99,69.9 169.09,69.9 169.65,70.46 169.65,70.6 168.99,71.26
N$44
  Top 0.406: 137.61,155.13 137.1,155.64 136.59,155.13
N$45
  Top 0.406: 156.53,150.82 157.04,151.32 157.55,150.82
N$46
  Top 0.406: 166.56,96.33 166.56,96.21 165.68,95.32 166.06,95.32 166.44,95.7
N$47
  Top 0.406: 136.08,101.67 136.59,102.18
N$48
  Top 0.406: 136.08,103.19 136.59,102.68
N$49
  Top 0.406: 135.07,102.68 135.58,103.19
N$50
  Top 0.406: 135.07,102.3 135.58,101.79
N$51
  Top 0.406: 137.48,102.68 137.99,103.19
N$52
  Top 0.406: 137.86,102.94 138.24,102.94
N$53
  Top 0.406: 137.35,102.56 138.12,103.32
N$54
  Top 0.406: 137.48,102.3 137.48,102.18 138.24,101.41 138.24,101.79 137.86,102.18
N$55
  Top 0.406: 180.13,82.93 180.1,82.93 179.41,82.24
N$56
  Top 0.813: 88.96,97.62 88.96,98.42 88.95,98.42
N$57
  Top 0.813: 89.86,97.57 89.13,97.57 89.11,97.6
N$58
  Top 0.406: 120.58,105.05 R4.1 120.65,104.97 122.2,104.97 | IC3.9 122.2,104.97 | C5.2 121.7,108.41 122.17,107.94 122.17,104.99 122.2,104.97
N$60
  Top 0.406: 180.19,82.96 180.19,82.95 180.93,82.21
N$62
  Top 0.254: 71.99,107.59 72.23,107.84
N$63
  Top 0.254: 72.34,107.92 72.35,107.92 72.69,107.59
N$64
  Top 0.254: 72.4,104.61 72.71,104.92
N$65
  Top 0.254: 72.3,104.57 72.3,104.58 72.02,104.86
N$68
  Top 0.254: 95.45,117.01 95.55,117.01 95.88,117.34
N$69
  Top 0.254: 95.5,117.93 95.5,117.91 95.98,117.43
N$70
  Top 0.254: 105.41,118.36 105.41,118.88
N$71
  Top 0.254: 105.48,118.25 106.12,118.25
N$72
  Top 0.406: 179.44,88.6 179.44,88.63 180.09,89.28
N$76
  Top 0.305: 51.87,67.46 51.87,67.47 52.33,67.93 52.07,67.93 51.97,67.83
N$77
  Top 0.305: 51.83,68.58 52.41,67.99
N$78
  Top 0.406: 32.68,122.86 33.03,122.86 33.09,122.93 33.18,123.02
N$79
  Bottom 0.406: 112.21,103.81 112.24,103.81 112.88,103.17 112.88,103.56 112.8,103.64
N$80
  Bottom 0.254: 86.54,125.48 86.6,125.48 87.08,125.01 87.08,124.5 86.69,124.11
N$81
  Bottom 0.254: 86.68,125.51 87.13,125.05
N$82
  Bottom 0.406: 112.98,136.04 112.98,136 112.42,135.45
N$83
  Bottom 0.254: 107.37,120.73 107.69,120.41
N$84
  Bottom 0.254: 107.2,120.81 107.2,120.75 106.87,120.42
N$86
  Top 0.406: 179.42,88.59 179.42,88.57 180.13,87.86
N$87
  Top 0.406: 171.3,98.54 171.3,98.56 172.05,99.32
N$88
  Top 0.406: 171.33,100.23 171.33,100.19 172.02,99.5
N$89
  Bottom 0.406: 90.56,149.23 90.61,149.19
N$90
  Bottom 0.406: 89.86,148.63 90.37,148.63 90.42,148.58
N$91
  Bottom 0.406: 90.37,148.63 90.37,148.58 90.59,148.37
N$92
  Bottom 0.406: 90.16,148.62 90.04,148.62 90,148.58
N$93
  Bottom 0.406: 90.9,148.35 90.97,148.35 91.43,148.81
N$94
  Bottom 0.406: 100.55,144.99 100.57,144.99 100.92,144.64
N$95
  Bottom 0.406: 100.45,145.16 100.45,145.15 99.99,144.69
N$96
  Bottom 0.406: 102.25,135.73 102.33,135.73 102.67,135.39
N$97
  Bottom 0.406: 102.24,135.82 102.2,135.82 101.85,135.47
N$98
  Bottom 0.406: 78.96,42.92 79.38,42.5
N$99
  Bottom 0.406: 78.81,43.02 78.78,43.02 78.36,42.6
N$100
  Bottom 0.406: 78.31,42.49 78.31,42.44 78.75,41.99
N$101
  Bottom 0.406: 78.83,42.02 78.83,42.04 79.27,42.48
N$102
  Bottom 0.406: 78.82,61.17 78.88,61.17 79.35,60.69
N$103
  Bottom 0.406: 79.36,60.69 79.35,60.69 78.92,60.26
N$104
  Bottom 0.406: 78.81,60.21 78.8,60.21 78.42,60.59
N$105
  Bottom 0.406: 78.27,60.71 78.69,61.13
N$107
  Top 0.406: 146.03,140.4 146.04,140.4 147.48,138.96
N$108
  Top 0.406: 157.03,151.56 157.03,151.54 156.38,150.89
N$109
  Top 0.406: 157.16,151.5 157.2,151.5 157.84,150.86
N$110
  Top 0.406: 51.83,149.48 52.44,148.85
N$111
  Top 0.406: 70.96,149.69 71.69,149.02
N$112
  Top 0.406: 51.84,149.23 51.85,149.23 52.17,148.91
N$113
  Top 0.406: 70.84,149.83 70.02,149.01
N$115
  Top 0.406: 70.92,149.47 70.92,149.46 71.48,148.89
N$116
  Top 0.406: 70.81,149.51 70.8,149.51 70.31,149.02
N$117
  Top 0.406: 91.03,123.57 90.97,123.57 90.85,123.69 90.85,123.84
N$118
  Top 0.305: 112.48,104.78 112.77,104.78 112.78,104.77
N$119
  Top 0.305: 112.81,104.76 112.98,104.94
N$120
  Top 0.305: 112.72,104.82 112.54,104.82 112.44,104.92
N$121
  Top 0.305: 112.81,104.84 113.02,105.05
N$122
  Top 0.305: 113.06,104.75 113.06,104.33 113.05,104.32
N$123
  Top 0.305: 117.52,103.26 117.52,103.2 116.89,102.57
N$124
  Top 0.305: 117.87,103.06 117.93,103.06 118.53,102.47 118.34,102.47 117.77,103.04
N$125
  Top 0.305: 122.13,105.39 122.12,105.39 121.82,105.08
N$126
  Top 0.305: 122.13,105.43 122.17,105.43 122.54,105.06
N$127
  Bottom 0.406: 86.51,97.13 86.53,97.13 87.04,96.62
N$128
  Top 0.406: 32.59,123.02 33.08,123.07
N$129
  Top 0.406: 26.06,92.67 26.7,93.22
N$130
  Bottom 0.254: 114.66,75.46 114.69,75.46 114.76,75.54
N$131
  Bottom 0.254: 114.69,75.37 114.69,75.44 114.85,75.59 115.07,75.59 115.09,75.57
N$132
  Bottom 0.305: 90.09,149.27 90.65,149.27 90.68,149.24
N$133
  Bottom 0.406: 70.93,34.52 71.26,34.82
N$134
  Bottom 0.406: 70.88,34.43 70.51,34.81
N$135
  Top 0.406: 25.26,93.22 25.92,92.55
N$136
  Top 0.406: 26.05,92.49 26.83,93.17
N$137
  Bottom 0.305: 121.33,73.08 120.9,72.68
N$138
  Bottom 0.305: 121.36,73.13 121.85,72.66
N$139
  Bottom 0.305: 114.58,75.27 114.85,75.55
N$140
  Bottom 0.305: 114.92,75.51 115.14,75.51 115.21,75.47
N$141
  Top 0.406: 59.05,96.69 59.79,95.93
N$142
  Top 0.406: 58.5,96.87 57.76,96.01
N$143
  Top 0.406: 88.53,98.77 88.56,97.67
N$144
  Top 0.305: 112.4,104.98 112.63,104.89 112.91,105
N$145
  Top 0.305: 112.83,104.96 112.98,105.23
N$146
  Top 0.406: 88.9,97.17 89.96,97.19
N$147
  Top 0.406: 137.31,102.64 138.23,103.64
N$148
  Top 0.406: 137.28,102.23 138.2,101.29
N$149
  Top 0.406: 122.18,105.52 122.74,105
N$150
  Top 0.813: 87.98,126.72 88.91,127.61
N$151
  Top 0.813: 87.95,126.44 87.13,127.49
N$152
  Top 0.813: 58.8,96.32 59.4,95.7
N$153
  Top 0.813: 58.74,96.4 58.19,95.72
N$154
  Top 0.406: 122.26,105.65 122.88,105.04
N$155
  Top 0.406: 122.2,105.65 121.69,105.07
N$156
  Top 0.406: 122.15,105.68 121.59,105.07
N$157
  Top 0.406: 112.3,105.07 112.79,105.15
N$158
  Top 0.406: 112.07,105.28 112.47,105.1 112.89,105.3
N$159
  Top 0.406: 112.9,105.3 112.97,105.49
N$160
  Top 0.406: 95.51,116.82 96.06,117.4
N$161
  Top 0.406: 95.5,118.1 96.11,117.49
N$162
  Top 0.406: 105.34,119.02 105.34,118.3
N$163
  Top 0.406: 105.38,118.18 106.24,118.19
N$164
  Top 0.406: 88.22,126.51 89.15,127.32
N$165
  Top 0.406: 87.66,126.46 86.85,127.31
N$166
  Bottom 0.406: 45.41,97 46.4,97
N$167
  Bottom 0.406: 45.94,96.87 45.89,96.75
N$168
  Bottom 0.406: 46.71,96.77 46.77,95.66 46.49,96.27
N$169
  Bottom 0.406: 86.59,95.52 87.24,96.15
N$170
  Bottom 0.406: 86.55,97.47 87.34,96.66
N$171
  Bottom 0.406: 34.46,75.7 35.62,75.7
N$172
  Bottom 0.406: 35.81,75.62 35.83,74.29
N$173
  Bottom 0.406: 61.14,130.81 61.86,130
N$174
  Bottom 0.406: 61.02,130.83 60.18,130.01
N$175
  Bottom 0.406: 100.33,145.33 99.73,144.69
N$176
  Bottom 0.406: 100.43,145.35 101.16,144.63
N$177
  Bottom 0.406: 102.3,135.96 102.88,135.42
N$178
  Bottom 0.406: 102.14,136.04 101.52,135.44
N$179
  Bottom 0.406: 111.94,135.4 112.85,136.24
N$180
  Bottom 0.406: 109.82,154.93 110.66,154.15
N$181
  Bottom 0.406: 110.79,154.06 111.68,154.86
N$182
  Bottom 0.406: 118.46,155.11 118.87,155.48
N$183
  Bottom 0.406: 121.48,73.27 122.08,72.69
N$184
  Bottom 0.406: 121.35,73.34 120.61,72.58
N$185
  Bottom 0.406: 114.65,75.28 114.83,75.46
N$186
  Bottom 0.406: 114.88,75.45 115.14,75.45 115.44,75.29
N$187
  Bottom 0.406: 112.11,103.78 112.91,103.01
POWER_BLOK_1  (via drill 0.6)
  Top 0.406: S3.3 157.06,150.82 157.04,150.82 156.91,150.69 | S4.3 168.13,137.23 164.53,137.23 163.01,138.75 163.01,148.53 160.85,150.69 156.91,150.69 | 90.75,151.2 90.75,151.96 | 90.75,151.96 RB1.2 | 137.1,158.06 S2.3 137.14,155.18 136.97,155.01 | 136.97,155.01 v118.94,155.01 | 136.97,155.01 145.74,155.01 147.51,156.79 149.8,156.79 155.9,150.69 156.91,150.69 | CS1.1 90.75,151.19 90.75,151.2 | 90.75,151.2 90.75,150.44 | 90.75,150.44 90.75,148.66 92.27,147.13 109.16,147.13 v110.81,148.78 | 90.75,150.44 91.38,151.07 91.13,151.07 90.87,150.82 | 90.75,151.96 90.87,151.96 91.51,151.32 91.25,151.32 90.87,151.71
  Bottom 0.254: 104.46,157.67 S0.3
  Bottom 0.406: S1.3 118.94,156.6 v118.94,155.01 110.81,155.01 | 110.81,155.01 105.35,155.01 104.46,155.9 104.46,157.67 | v110.81,148.78 110.81,154.12 | 110.81,154.12 110.81,154.25 | 110.81,154.25 110.81,154.37 | 110.81,154.37 110.81,155.01 | 110.81,154.37 111.32,154.88 | 110.81,154.25 110.68,154.25 | 110.68,154.25 110.18,154.75 | 110.68,154.25 110.81,154.12 | 110.81,154.25 110.94,154.25 111.45,154.75 110.3,154.75
POWER_BLOK_2  (via drill 0.6)
  Top 0.254: 170.48,70.55 170.55,70.55 S7.3
  Top 0.406: CS2.1 180.15,88.59 | v171.26,92.27 178.12,92.27 180.15,90.24 180.15,89.09 | 180.15,89.09 180.15,88.59 | 180.15,88.59 180.15,88.08 | 180.15,88.08 180.15,82.62 | 180.15,82.62 180.15,82.11 | 180.15,82.11 180.66,82.11 | 180.66,82.11 RB2.2 | 180.15,82.11 179.65,82.11 | 179.65,82.11 175.2,82.11 168.98,75.89 168.98,71.06 | S6.3 171.9,99.38 | 171.9,99.38 171.52,99.38 | 168.98,71.06 168.98,70.55 | 170.48,70.55 169.49,70.55 | 169.49,70.55 168.98,70.55 | 168.98,70.55 168.98,70.04 | 168.98,70.04 168.98,68.39 156.53,55.95 v156.53,53.03 | 171.39,99.89 171.9,99.38 | 171.9,99.38 171.39,98.87 | v171.26,97.22 171.26,98.87 171.39,98.87 | 180.15,89.09 179.65,88.59 180.15,88.08 | 180.66,82.11 180.15,82.62 | 180.15,82.62 179.65,82.11 | 168.98,71.06 169.49,70.55 | 169.49,70.55 168.98,70.04 | S5.3 172.75,119.03 171.26,117.54 171.26,99 171.39,98.87
  Bottom 0.406: S8.3 153.47,46.82 152.09,48.2 152.09,48.45 | S9.3 128.53,35.69 130.5,37.66 141.29,37.66 152.09,48.45 | 155.78,52.26 v156.53,53.03 156.53,53.01 155.78,52.26 | 155.78,52.26 152.09,48.45 | v171.26,97.22 v171.26,92.27
POWER_BLOK_3  (via drill 0.6)
  Top 0.406: S10.3 97.98,26.48 96.84,25.34 CS3.1 92.27,25.34 91.63,25.34 | 91.63,25.34 91.63,24.83 | 91.63,24.83 RB3.2 | 91.63,25.34 86.68,25.34 v84.4,27.37 | v36.64,67.25 36.9,67.25 39.56,64.58 46.3,64.58 49.85,61.03 v49.85,54.3 | 91.63,24.83 92.14,25.34 | 91.63,24.83 91.25,25.21
  Bottom 0.406: S13.3 31.44,75.4 31.58,75.4 32.58,76.39 33.6,76.39 35.06,74.93 | 35.06,74.93 36.64,73.35 v36.64,67.25 | S14.3 27.88,104.46 28.77,103.57 28.77,99 35.12,92.65 36.9,92.65 39.06,90.49 39.06,78.93 35.63,75.51 | S11.3 70.87,34.93 70.85,34.95 | v84.4,27.37 84.14,27.5 76.69,34.95 70.85,34.95 | 35.63,75.51 35.37,75.25 | 35.37,75.25 35.06,74.93 | S12.3 46.79,51.48 49.6,54.3 v49.85,54.3 53.73,54.3 54.9,53.12 54.9,47.93 67.88,34.95 70.85,34.95 | 35.5,74.62 35.5,75.12 35.37,75.25 | 34.74,75.51 35.63,75.51 | 35.63,75.51 35.63,74.74 | 35.63,74.49 35.63,74.74 | 35.63,74.74 34.99,75.38
POWER_BLOK_4  (via drill 0.6)
  Top 0.254: 29.68,123.87 S15.3
  Top 0.406: S18.3 70.85,149.02 70.68,148.85 | CS4.1 22.29,90.87 24.71,93.29 25.47,93.29 | 25.47,93.29 26.1,93.29 | 26.1,93.29 26.48,93.29 | RB4.2 25.98,92.78 | 25.98,92.78 25.98,93.16 26.1,93.29 | S19.3 89.64,156.83 81.66,148.85 70.68,148.85 | 25.47,93.29 25.98,92.78 | 25.98,92.78 26.48,93.29 | 51.82,148.85 v51.82,149.74 | 51.82,148.85 70.68,148.85 | 29.68,123.87 31.59,123.87 33.21,122.24 | 33.21,122.24 33.21,101.16 33.98,100.4 33.98,97.48 29.79,93.29 26.48,93.29 | 33.21,122.24 v33.21,123.77 | 38.93,123.78 v38.93,123.77 38.93,123.9 39.32,124.29 39.32,136.35 v44.71,141.74 51.82,148.85
  Bottom 0.254: 37.91,141.84 S16.3
  Bottom 0.406: S17.3 50.38,157.02 51.88,155.52 51.88,149.55 | 51.88,149.55 52.01,149.8 v51.82,149.74 51.88,149.55 | v33.21,123.77 v38.93,123.77 | 37.91,141.84 44.6,141.84 v44.71,141.74
RESET
  Top 0.813: IC2.9 69.76,97.35 70.37,96.74 R3.1
RESET_COMMAND_1
  Top 0.406: PROG_CON1.5 102.18,116.27 107.9,110.55 117.01,110.62 117.62,110.01 117.62,108.45 C5.1
RX_0  (via drill 0.6)
  Top 0.406: JP1.2 v137.1,89.73
  Bottom 0.406: IC3.15 v137.1,89.73
RX_BT
  Top 0.406: IC3.3 131.64,120.21 134.31,122.75 134.31,129.1 140.78,135.58 SERIAL_EXTRA.3
RX_LINEE  (via drill 0.6)
  Top 0.406: v123.51,67.38 123.51,83 125.16,84.65 IC3.17 | v154.5,88.21 v154.5,68.14
  Bottom 0.406: v123.51,67.38 123.51,66.87 133.29,57.09 149.8,57.09 153.48,60.77 153.48,67.25 154.37,68.14 v154.5,68.14 | PL1.15 v154.5,88.21
SCK_SPI  (via drill 0.6)
  Top 0.406: PIXY_CON.3 99.64,130.24 95.44,126.05 95.44,117.67 | 95.44,117.67 95.44,116.15 99.76,111.83 v99.76,98.49 | IC2.8 v99.76,94.81 | 104.72,122.11 PROG_CON1.7 104.72,119.7 105.79,118.62 | v97.03,117.48 95.63,117.48 95.44,117.67 | 105.79,118.62 106.87,117.54 106.89,117.56 114.21,117.56 124.27,107.51 IC3.8 | v104.72,117.54 105.79,118.62
  Bottom 0.406: v99.76,98.49 v99.76,94.81 | v104.72,117.54 97.03,117.54 v97.03,117.48
SCL_I2C  (via drill 0.6)
  Top 0.406: IC3.22 140.28,79.57 139.01,78.3 139.01,72.71 v138.94,72.65 | US_SUD.3 103.45,46.8 121.35,64.71 v121.35,74.74 | US_OVEST.3 35.63,102.43 34.61,103.57 v34.61,118.69 | v87.82,135.32 v70.81,135.32 | v113.04,106.4 113,106.37 113,104.61 112.85,104.45 | v113.08,125.24 v118.98,125.24 v119,125.26 | v114.61,102.33 114.61,102.69 112.85,104.45 | 112.85,104.45 U$17.SCL
  Bottom 0: 121.35,72.67 120.35,72.67 120.26,72.58
  Bottom 0.305: 148.4,72.58 139.01,72.58 v138.94,72.65
  Bottom 0.406: US_EST.3 163.39,102.43 161.99,101.03 161.99,86.17 148.4,72.58 120.26,72.58 120.09,72.58 116.72,75.96 116.72,81.28 114.91,83.08 114.91,83.1 114.61,83.4 v114.61,102.33 | 112.97,135.45 112.97,143.58 111.07,145.74 104.21,145.74 102.81,147.13 102.81,151.32 US_NORD.3 | v87.82,135.32 102.18,135.32 PIXY_CON.5 102.18,135.45 102.3,135.32 112.84,135.32 112.97,135.45 | 112.97,135.45 119,129.42 v119,125.26 | v34.61,118.69 39.82,118.69 50.99,129.86 61.15,129.86 | 61.15,129.86 68.01,129.86 70.81,132.66 v70.81,135.32 | I2C-EXTRA.3 61.03,130.62 | 61.03,130.62 61.03,130.5 | 61.03,130.5 61.03,129.99 61.15,129.86 | 61.03,130.5 61.15,130.5 61.66,129.99 61.54,129.99 61.28,130.24 | 61.03,130.62 60.39,129.99 60.77,129.99 60.9,130.12 | v113.04,106.4 113.04,114.65 113.07,114.68 113.07,125.23 v113.08,125.24 | v121.35,74.74 121.35,72.67 121.4,72.62
SDA_I2C  (via drill 0.6)
  Top 0.406: IC3.23 144.34,82.11 145.86,80.59 v145.86,70.93 | US_SUD.2 100.91,46.55 114.62,60.27 v114.62,73.98 | v111.57,133.29 109.8,135.07 108.14,135.07 107.26,135.96 PIXY_CON.9 | v44.26,103.19 44.26,134.69 v44.14,134.81
  Bottom 0.406: US_OVEST.2 42.74,99.89 44.26,101.41 v44.26,103.19 | v44.14,134.81 57.22,134.81 58.49,136.08 I2C-EXTRA.2 58.49,140.53 61.79,143.83 88.21,143.83 89.73,142.31 92.52,142.31 94.68,144.47 100.27,144.47 | US_EST.2 164.79,99.89 163.39,98.49 163.39,85.79 148.53,70.93 v145.86,70.93 119.83,70.93 114.64,76.13 | 100.27,144.47 110.3,144.47 111.7,142.94 111.7,138.88 110.3,137.48 PIXY_CON.9 | US_NORD.2 100.4,144.59 100.27,144.47 | v111.57,133.29 111.57,133.16 116.78,127.96 116.78,118.3 114.47,115.99 114.47,105.47 114.19,105.19 114.18,105.19 112.99,104 112.99,103.83 | v114.62,73.98 114.62,75.63 | 114.62,75.63 114.62,76.14 | U$17.SDA 112.99,103.83 | 112.99,103.83 112.97,103.85 112.97,81.99 114.64,80.33 114.64,76.13 | 114.64,76.13 114.64,75.64 114.62,75.63
SENSORE0  (via drill 0.6)
  Top 0.406: v51.76,137.86 46.55,132.66 46.55,107.26 48.84,104.97 IC2.29
  Bottom 0.406: 51.88,137.86 v51.76,137.86 51.76,137.99 51.88,137.99 62.13,148.23 85.83,148.23 88.8,151.2 92.78,151.2 S0.1
SENSORE1  (via drill 0.6)
  Top 0.406: IC2.28 49.98,107.51 47.69,109.8 47.69,128.08 53.79,134.18 66.74,134.18 70.68,138.12 v85.41,138.12 | v113.22,146.12 113.35,145.99 v109.54,142.31 | S1.1 113.88,158.2 113.22,157.55 v113.22,152.98
  Bottom 0.406: v113.22,152.98 v113.22,146.12 | v85.41,138.12 85.54,138.12 88.46,141.04 93.03,141.04 95.19,143.2 108.65,143.2 v109.54,142.31 108.91,142.94
SENSORE2  (via drill 0.6)
  Top 0.406: IC2.27 49.98,110.05 48.84,111.19 48.84,127.58 54.17,132.91 88.73,132.91 91.42,135.6 91.78,135.96 91.78,141.15 95.11,144.48 108.52,144.48 108.53,144.47 111.45,147.39 v119.45,147.39
  Bottom 0.406: 132.74,160.55 S2.1 132.66,160.51 132.66,149.29 130.75,147.39 v119.45,147.39
SENSORE3  (via drill 0.6)
  Top 0.406: IC2.26 51.25,112.59 50.23,113.61 50.23,127.19 54.68,131.64 v87.7,131.64 | v148.66,155.52 v148.66,150.05 | v118.56,135.32 114.88,131.64 v101.92,131.64
  Bottom 0.406: S3.1 150.2,157.06 v148.66,155.52 | v101.92,131.64 v87.7,131.64 | v118.56,135.32 126.43,143.2 141.67,143.2 148.53,150.05 v148.66,150.05
SENSORE4  (via drill 0.6)
  Top 0.406: v160.47,145.48 160.47,145.36 v152.21,145.36 | v118.56,133.29 115.13,129.86 v102.05,129.86 | IC2.25 55.44,115.13 58.11,117.8 58.11,127.7 60.27,129.86 v87.7,129.86
  Bottom 0.406: S4.1 163.98,141.97 v160.47,145.48 | v102.05,129.86 v87.7,129.86 | v118.56,133.29 126.94,141.67 148.66,141.67 152.21,145.23 v152.21,145.36
SENSORE5  (via drill 0.6)
  Top 0.406: v55.19,122.75 55.19,118.81 54.04,117.67 IC2.24 | v169.74,97.35 169.74,121.48 171.52,123.26 S5.1 | v61.38,75.39 61.41,73.47 67.25,67.63 80.84,67.63 87.44,74.24 v109.92,74.24
  Bottom 0.406: v61.38,75.39 61.41,120.34 59,122.75 v55.19,122.75 | v169.74,97.35 169.74,85.92 | 169.74,85.92 169.74,85.79 | 169.74,85.92 156.91,73.09 152.98,73.09 149.17,69.28 114.88,69.28 v109.92,74.24
SENSORE6  (via drill 0.6)
  Top 0.406: v167.45,78.93 166.44,78.05 166.25,77.85 166.25,67.57 156.28,57.6 153.1,57.6 v146.12,50.61 | v172.91,104.46 S6.1 | v59.25,75.42 59.25,69.41 62.93,65.73 62.93,49.72 66.49,46.17 v92.4,46.17
  Bottom 0.406: v167.45,78.93 172.91,84.4 v172.91,104.46 | v146.12,50.61 141.67,46.17 v92.4,46.17 | IC2.23 58.49,120.21 59.79,118.91 60.14,118.56 60.15,118.55 60.15,77.31 59.25,76.41 v59.25,75.42
SENSORE7  (via drill 0.6)
  Top 0.406: v132.78,63.31 128.21,63.31 123.38,58.49 v119.57,58.49 | v90.75,64.33 88.84,66.23 66.36,66.23 61.66,70.93 61.66,71.06 v61.41,71.19
  Bottom 0.406: S7.1 168.53,75.31 164.02,70.81 152.85,70.81 145.36,63.31 v132.78,63.31 | v61.41,71.19 60.01,72.58 54.17,72.58 50.11,76.65 50.11,121.35 51.5,122.75 IC2.22 | v119.57,58.49 115,58.49 112.72,58.49 96.59,58.49 v90.75,64.33
SENSORE8  (via drill 0.6)
  Top 0.406: S8.1 | S8.1 157.17,50.49 | v153.74,53.66 153.77,53.66 S8.1 | v96.71,44.39 96.71,56.33 87.82,65.22 65.09,65.22 v60.39,69.92
  Bottom 0.406: v153.74,53.66 143.96,44.39 v96.71,44.39 | v60.39,69.92 59.12,71.19 54.04,71.19 48.58,76.65 48.58,106.11 48.71,123.26 50.74,125.29 IC2.21
SENSORE9  (via drill 0.6)
  Top 0.406: S9.1 133.22,40.14 v133.16,40.2 | v94.43,42.49 94.43,56.33 86.55,64.2 v64.2,64.2
  Bottom 0.406: IC2.20 66.36,125.29 64.2,123.13 v64.2,64.2 | v133.16,40.2 130.88,42.49 v94.43,42.49
SENSORE10
  Bottom 0.406: IC2.19 66.36,122.75 65.6,121.99 65.6,62.81 65.09,62.3 65.09,56.71 73.73,48.07 73.73,40.58 87.7,26.61 92.9,26.61 96.21,29.91 102.68,29.91 104.46,28.13 S10.1
SENSORE11  (via drill 0.6)
  Top 0.406: IC2.18 64.08,120.21 62.93,119.07 v62.93,105.1 | v62.93,94.68 v62.93,81.98 | v76.27,36.14 76.27,31.8 S11.1
  Bottom 0.406: 75.63,31.17 S11.1 75.76,31.29 | v62.93,105.1 v62.93,94.68 | v76.27,36.14 72.46,39.95 72.46,47.95 62.93,57.47 v62.93,81.98
SENSORE12  (via drill 0.6)
  Top 0.406: v52.9,52.52 52.9,59.76 55.44,62.3 55.44,75.63 54.04,77.03 IC2.40
  Bottom 0.406: S12.1 50.47,46.79 52.9,49.72 v52.9,52.52
SENSORE13
  Top 0.406: IC2.39 52.52,79.44 47.69,79.44 38.87,70.62 S13.1
SENSORE14  (via drill 0.6)
  Top 0.406: S14.1 30.8,99.38 v30.8,99.25 | IC2.38 50.99,82.11 44.9,88.21 43.63,88.21 37.66,94.17 v37.28,94.56
  Bottom 0.406: v30.8,99.25 31.06,99.25 35.75,94.56 v37.28,94.56
SENSORE15  (via drill 0.6)
  Top 0.406: IC2.37 50.87,84.65 45.91,89.6 44.01,89.6 39.56,94.05 39.56,110.18 38.68,111.19 v37.66,111.19
  Bottom 0.406: v37.66,111.19 32.96,111.19 28.39,115.76 28.39,119 S15.1
SENSORE16
  Top 0.406: IC2.36 50.87,87.19 47.18,90.87 44.52,90.87 40.71,94.68 40.71,118.3 37.4,121.61 36.52,122.5 35.37,123.64 S16.1
SENSORE17  (via drill 0.6)
  Top 0.406: IC2.35 50.74,89.73 48.33,92.14 45.03,92.14 41.85,95.32 41.85,119.95 41.03,120.9 41.03,136.04 46.67,141.67 v46.93,141.67
  Bottom 0.406: v46.93,141.67 46.8,153.45 S17.1
SENSORE18  (via drill 0.6)
  Top 0.406: IC2.34 51.25,92.27 50.11,93.41 45.66,93.41 42.99,96.08 42.99,121.3 42.75,121.54 42.75,135.68 v53.46,146.4
  Bottom 0.406: S18.1 65.12,158.06 | 65.12,158.06 65.09,158.06 | v53.46,146.4 65.12,158.06
SENSORE19  (via drill 0.6)
  Top 0.406: IC2.33 45.91,94.81 44.26,96.46 44.26,99.89 45.41,101.03 45.41,133.93 v55.99,144.47 | v73.35,152.09 81.6,152.09 84.9,155.39 84.9,156.98 S19.1
  Bottom 0.406: v73.35,152.09 63.44,152.09 55.99,144.63 v55.99,144.47
SS_644  (via drill 0.6)
  Top 0.406: IC3.5 127.83,115.13 128.08,115 129.61,113.48 129.61,72.33 127.58,70.17 127.58,65.6 123.26,61.28 v119.57,61.28 | v112.72,61.28 v112.72,73.98 | v109.54,83.51 91.38,83.51 v84.4,90.49
  Bottom 0.406: v119.57,61.28 v112.72,61.28 | v84.4,90.49 72.71,90.49 69.41,87.19 IC2.5 | v112.72,73.98 112.72,80.33 v109.54,83.51
SS_PIXY  (via drill 0.6)
  Top 0.406: v115,121.23 117.16,119.19 118.69,117.67 IC3.4 | PIXY_CON.7 104.72,134.56 106.11,133.16 v109.03,133.16
  Bottom 0.406: v115,121.23 115,127.19 v109.03,133.16
TX_0  (via drill 0.6)
  Top 0.406: v135.58,92.27 135.58,70.68 134.56,69.66 JP1.3
  Bottom 0.406: IC3.14 v135.58,92.27
TX_BT  (via drill 0.6)
  Top 0.406: IC3.2 131.51,122.75 132.91,124.15 132.91,129.48 137.35,133.93 v137.35,145.1
  Bottom 0.406: v137.35,145.1 140.91,145.1 143.32,147.51 SERIAL_EXTRA.2
TX_LINEE
  Bottom 0.406: PL1.13 155.64,99.89 157.17,98.37 157.17,88.33 154.63,85.79 147.51,85.79 144.59,82.87 144.59,76.78 142.69,74.87 140.53,74.87 137.61,77.79 137.61,85.28 135.83,87.06 126.56,87.06 IC3.16
VMOT
  Bottom 1.422: SW_MOTORI.1 155.77,60.9 150.18,55.31 132.66,55.31 120.46,67.5 113.22,67.5 107.26,73.47 VMOT.1